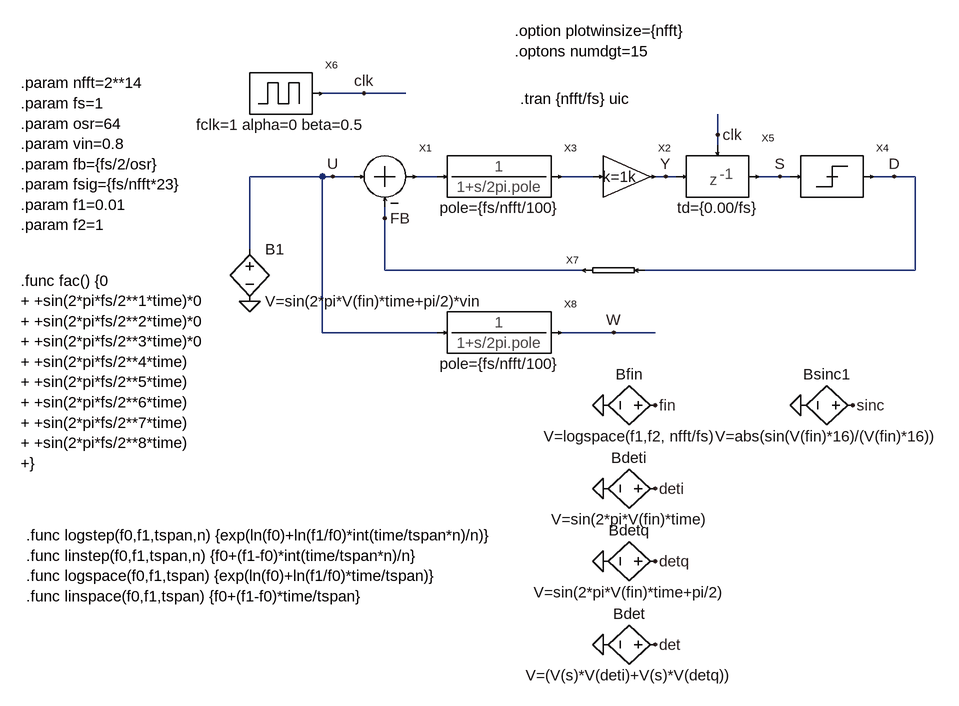
[diagram p0: schematic sample-ctdsm1-ac.asc]
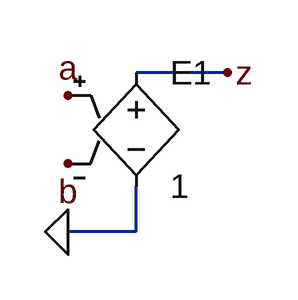
[diagram p1: sub-circuit sub.asc]
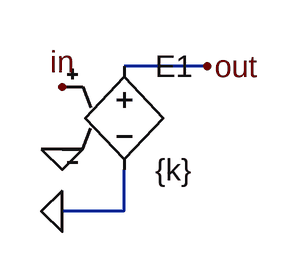
[diagram p2: sub-circuit gain.asc]
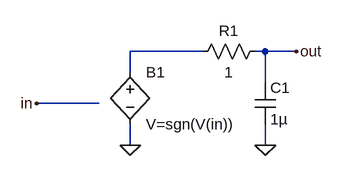
[diagram p3: sub-circuit sgn.asc]
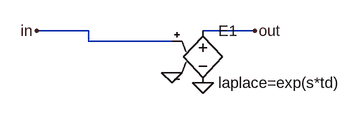
[diagram p4: sub-circuit delay.asc]
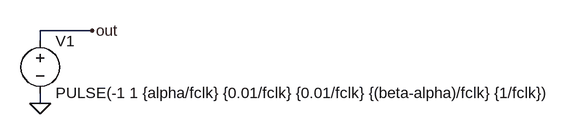
[diagram p5: sub-circuit clk.asc]
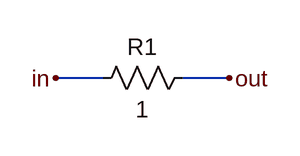
[diagram p6: sub-circuit connect.asc]
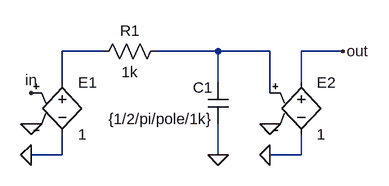
[diagram p7: sub-circuit pole.asc]
sample-ctdsm1-ac.asc, the LTspice schematic file:
Version 4
SHEET 1 976 1224
WIRE 32 32 -32 32
WIRE 96 32 32 32
WIRE 576 96 576 64
WIRE 576 112 576 96
WIRE -32 160 -144 160
WIRE -16 160 -32 160
WIRE 16 160 -16 160
WIRE 144 160 112 160
WIRE 384 160 336 160
WIRE 496 160 480 160
WIRE 512 160 496 160
WIRE 672 160 640 160
WIRE 688 160 672 160
WIRE 848 160 816 160
WIRE 880 160 848 160
WIRE 64 224 64 208
WIRE -144 272 -144 160
WIRE 64 304 64 224
WIRE 368 304 64 304
WIRE 880 304 880 160
WIRE 880 304 464 304
WIRE -32 400 -32 160
WIRE 144 400 -32 400
WIRE 416 400 336 400
WIRE 480 400 416 400
FLAG 576 96 clk
FLAG 848 160 D
FLAG 496 160 Y
FLAG -16 160 U
FLAG 64 224 FB
FLAG 32 32 clk
FLAG 416 400 W
FLAG -144 352 0
FLAG 400 880 0
FLAG 480 880 det
FLAG 400 752 0
FLAG 480 752 detq
FLAG 400 512 0
FLAG 480 512 fin
FLAG 400 640 0
FLAG 480 640 deti
FLAG 672 160 S
FLAG 704 512 0
FLAG 784 512 sinc
SYMBOL sub 64 160 R0
SYMATTR InstName X1
SYMBOL gain 432 160 R0
SYMATTR InstName X2
SYMATTR SpiceLine k=1k
SYMBOL sgn 752 160 R0
SYMATTR InstName X4
SYMBOL delay 576 160 R0
SYMATTR InstName X5
SYMATTR SpiceLine td={0.00/fs}
SYMBOL clk -96 32 R0
SYMATTR InstName X6
SYMBOL connect 416 304 M0
SYMATTR InstName X7
SYMBOL pole 240 160 R0
SYMATTR SpiceLine pole={fs/nfft/100}
SYMATTR InstName X3
SYMBOL pole 240 400 R0
SYMATTR SpiceLine pole={fs/nfft/100}
SYMATTR InstName X8
SYMBOL bv -144 256 R0
SYMATTR InstName B1
SYMATTR Value V=sin(2*pi*V(fin)*time+pi/2)*vin
SYMBOL bv 496 880 R90
WINDOW 0 -32 56 VBottom 2
WINDOW 3 32 56 VTop 2
SYMATTR InstName Bdet
SYMATTR Value V=(V(s)*V(deti)+V(s)*V(detq))
SYMBOL bv 496 752 R90
WINDOW 0 -32 56 VBottom 2
WINDOW 3 32 56 VTop 2
SYMATTR InstName Bdetq
SYMATTR Value V=sin(2*pi*V(fin)*time+pi/2)
SYMBOL bv 496 512 R90
WINDOW 0 -32 56 VBottom 2
WINDOW 3 32 56 VTop 2
SYMATTR InstName Bfin
SYMATTR Value V=logspace(f1,f2, nfft/fs)
SYMBOL bv 496 640 R90
WINDOW 0 -32 56 VBottom 2
WINDOW 3 32 56 VTop 2
SYMATTR InstName Bdeti
SYMATTR Value V=sin(2*pi*V(fin)*time)
SYMBOL bv 800 512 R90
WINDOW 0 -32 56 VBottom 2
WINDOW 3 32 56 VTop 2
SYMATTR InstName Bsinc1
SYMATTR Value V=abs(sin(V(fin)*16)/(V(fin)*16))
TEXT 272 40 Left 2 !.tran {nfft/fs} uic
TEXT -496 16 Left 2 !.param nfft=2**14\n.param fs=1\n.param osr=64\n.param vin=0.8\n.param fb={fs/2/osr}\n.param fsig={fs/nfft*23}\n.param f1=0.01\n.param f2=1
TEXT 264 -64 Left 2 !.option plotwinsize={nfft}\n.optons numdgt=15
TEXT -496 320 Left 2 !.func fac() {0\n+ +sin(2*pi*fs/2**1*time)*0\n+ +sin(2*pi*fs/2**2*time)*0\n+ +sin(2*pi*fs/2**3*time)*0\n+ +sin(2*pi*fs/2**4*time)\n+ +sin(2*pi*fs/2**5*time)\n+ +sin(2*pi*fs/2**6*time)\n+ +sin(2*pi*fs/2**7*time)\n+ +sin(2*pi*fs/2**8*time)\n+}
TEXT -488 712 Left 2 !.func logstep(f0,f1,tspan,n) {exp(ln(f0)+ln(f1/f0)*int(time/tspan*n)/n)}\n.func linstep(f0,f1,tspan,n) {f0+(f1-f0)*int(time/tspan*n)/n}\n.func logspace(f0,f1,tspan) {exp(ln(f0)+ln(f1/f0)*time/tspan)}\n.func linspace(f0,f1,tspan) {f0+(f1-f0)*time/tspan}

sub.asc, the sub-circuit schematic file:
Version 4
SHEET 1 880 680
WIRE 304 112 240 112
WIRE 240 224 240 192
WIRE 240 224 192 224
FLAG 192 128 a
FLAG 192 224 0
FLAG 304 112 z
FLAG 192 176 b
SYMBOL e 240 96 R0
SYMATTR InstName E1
SYMATTR Value 1

gain.asc, the sub-circuit schematic file:
Version 4
SHEET 1 880 680
WIRE 304 112 240 112
WIRE 240 224 240 192
WIRE 240 224 192 224
FLAG 192 128 in
FLAG 192 224 0
FLAG 304 112 out
FLAG 192 176 0
SYMBOL e 240 96 R0
SYMATTR InstName E1
SYMATTR Value {k}

sgn.asc, the sub-circuit schematic file:
Version 4
SHEET 1 880 680
WIRE 448 48 336 48
WIRE 544 48 528 48
WIRE 592 48 544 48
WIRE 336 80 336 48
WIRE 544 96 544 48
WIRE 288 128 192 128
WIRE 336 192 336 160
WIRE 544 192 544 160
FLAG 192 128 in
FLAG 592 48 out
FLAG 336 192 0
FLAG 544 192 0
SYMBOL bv 336 64 R0
SYMATTR InstName B1
SYMATTR Value V=sgn(V(in))
SYMBOL res 544 32 R90
WINDOW 0 0 56 VBottom 2
WINDOW 3 32 56 VTop 2
SYMATTR InstName R1
SYMATTR Value 1
SYMBOL cap 528 96 R0
SYMATTR InstName C1
SYMATTR Value 1µ

delay.asc, the sub-circuit schematic file:
Version 4
SHEET 1 880 680
WIRE 192 144 112 144
WIRE 448 144 368 144
WIRE 192 160 192 144
WIRE 320 160 192 160
FLAG 112 144 in
FLAG 448 144 out
FLAG 320 208 0
FLAG 368 224 0
SYMBOL e 368 128 R0
SYMATTR InstName E1
SYMATTR Value laplace=exp(s*td)

clk.asc, the sub-circuit schematic file:
Version 4
SHEET 1 1192 680
WIRE 448 144 368 144
WIRE 368 160 368 144
WIRE 368 256 368 240
FLAG 448 144 out
FLAG 368 256 0
SYMBOL voltage 368 144 R0
WINDOW 123 0 0 Left 2
WINDOW 39 0 0 Left 2
SYMATTR InstName V1
SYMATTR Value PULSE(-1 1 {alpha/fclk} {0.01/fclk} {0.01/fclk} {(beta-alpha)/fclk} {1/fclk})

connect.asc, the sub-circuit schematic file:
Version 4
SHEET 1 880 680
WIRE 240 128 192 128
WIRE 368 128 320 128
FLAG 192 128 in
FLAG 368 128 out
SYMBOL res 336 112 R90
WINDOW 0 0 56 VBottom 2
WINDOW 3 32 56 VTop 2
SYMATTR InstName R1
SYMATTR Value 1

pole.asc, the sub-circuit schematic file:
Version 4
SHEET 1 880 680
WIRE 304 64 240 64
WIRE 480 64 384 64
WIRE 560 64 480 64
WIRE 672 64 608 64
WIRE 240 112 240 64
WIRE 480 112 480 64
WIRE 608 112 608 64
WIRE 560 128 560 64
WIRE 240 224 240 192
WIRE 240 224 192 224
WIRE 480 224 480 176
WIRE 608 224 608 192
WIRE 608 224 560 224
FLAG 192 128 in
FLAG 192 224 0
FLAG 672 64 out
FLAG 192 176 0
FLAG 480 224 0
FLAG 560 224 0
FLAG 560 176 0
SYMBOL e 240 96 R0
SYMATTR InstName E1
SYMATTR Value 1
SYMBOL res 400 48 R90
WINDOW 0 0 56 VBottom 2
WINDOW 3 32 56 VTop 2
SYMATTR InstName R1
SYMATTR Value 1k
SYMBOL cap 496 176 R180
WINDOW 0 24 56 Left 2
WINDOW 3 24 8 Left 2
SYMATTR InstName C1
SYMATTR Value {1/2/pi/pole/1k}
SYMBOL e 608 96 R0
SYMATTR InstName E2
SYMATTR Value 1

The netlist it stands for:
* sample-ctdsm1-ac.asc
XX1 U FB N001 sub
XX2 N002 Y gain params: k=1k
XX4 S D sgn
XX5 Y S clk delay params: td={0.00/fs}
XX6 clk clk params: fclk=1 alpha=0 beta=0.5
XX7 D FB connect
XX3 N001 N002 pole params: pole={fs/nfft/100}
XX8 U W pole params: pole={fs/nfft/100}
B1 U 0 V=sin(2*pi*V(fin)*time+pi/2)*vin
Bdet det 0 V=(V(s)*V(deti)+V(s)*V(detq))
Bdetq detq 0 V=sin(2*pi*V(fin)*time+pi/2)
Bfin fin 0 V=logspace(f1,f2, nfft/fs)
Bdeti deti 0 V=sin(2*pi*V(fin)*time)
Bsinc1 sinc 0 V=abs(sin(V(fin)*16)/(V(fin)*16))

* block symbol definitions
.subckt sub a b z
E1 z 0 a b 1
.ends sub

.subckt gain in out
E1 out 0 in 0 {k}
.ends gain

.subckt sgn in out
B1 N001 0 V=sgn(V(in))
R1 out N001 1
C1 out 0 1µ
.ends sgn

.subckt delay in out clk
E1 out 0 in 0 laplace=exp(s*td)
.ends delay

.subckt clk out
V1 out 0 PULSE(-1 1 {alpha/fclk} {0.01/fclk} {0.01/fclk} {(beta-alpha)/fclk} {1/fclk})
.ends clk

.subckt connect in out
R1 out in 1
.ends connect

.subckt pole in out
E1 N001 0 in 0 1
R1 N002 N001 1k
C1 0 N002 {1/2/pi/pole/1k}
E2 out 0 N002 0 1
.ends pole

.tran {nfft/fs} uic
.param nfft=2**14
.param fs=1
.param osr=64
.param vin=0.8
.param fb={fs/2/osr}
.param fsig={fs/nfft*23}
.param f1=0.01
.param f2=1
.option plotwinsize={nfft}
.optons numdgt=15
.func fac() {0
+ +sin(2*pi*fs/2**1*time)*0
+ +sin(2*pi*fs/2**2*time)*0
+ +sin(2*pi*fs/2**3*time)*0
+ +sin(2*pi*fs/2**4*time)
+ +sin(2*pi*fs/2**5*time)
+ +sin(2*pi*fs/2**6*time)
+ +sin(2*pi*fs/2**7*time)
+ +sin(2*pi*fs/2**8*time)
+}
.func logstep(f0,f1,tspan,n) {exp(ln(f0)+ln(f1/f0)*int(time/tspan*n)/n)}
.func linstep(f0,f1,tspan,n) {f0+(f1-f0)*int(time/tspan*n)/n}
.func logspace(f0,f1,tspan) {exp(ln(f0)+ln(f1/f0)*time/tspan)}
.func linspace(f0,f1,tspan) {f0+(f1-f0)*time/tspan}
.backanno
.end